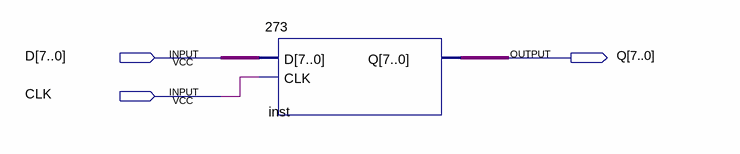
[diagram p0: schematic sheet]
// Quartus schematic register2627.bdf as structural Verilog: 1 symbols, 3 pins
module register2627 (
  input  [7:0] D,
  input  CLK,
  output [7:0] Q
);

  \273  inst (.D(D), .CLK(CLK), .Q(Q));
endmodule
